# Altium schematic sheet ECG FRONT.SchDoc
size A
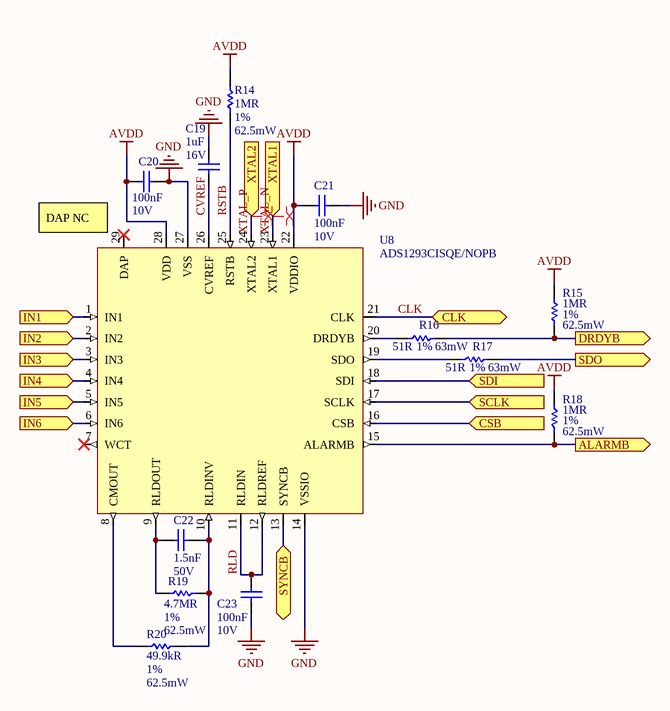
[diagram p0: ECG FRONT.SchDoc]

## Parts
C19  Voltage Rating: 16V  Capacitance: 1uF  [0402 CAPACITOR]  (hidden comment: EMK105BJ105KV-F)
C20  Capacitance: 100nF  Voltage Rating: 10V  [0402 CAPACITOR]  (hidden comment: C0402C104K8PACTU)
C21  Capacitance: 100nF  Voltage Rating: 10V  [0402 CAPACITOR]  (hidden comment: C0402C104K8PACTU)
C22  Capacitance: 1.5nF  Voltage Rating: 50V  [0402 CAPACITOR]  (hidden comment: 0402B152J500CT)
C23  Capacitance: 100nF  Voltage Rating: 10V  [0402 CAPACITOR]  (hidden comment: C0402C104K8PACTU)
R14  Resistance: 1MR  Tolerance: 1%  Power Rating: 62.5mW  [0402 RESISTOR]  (hidden comment: MCWR04X1004FTL)
R15  Resistance: 1MR  Tolerance: 1%  Power Rating: 62.5mW  [0402 RESISTOR]  (hidden comment: MCWR04X1004FTL)
R16  Resistance: 51R  Tolerance: 1%  Power Rating: 63mW  [0402 RESISTOR]  (hidden comment: CRCW040251R0FKED)
R17  Resistance: 51R  Tolerance: 1%  Power Rating: 63mW  [0402 RESISTOR]  (hidden comment: CRCW040251R0FKED)
R18  Resistance: 1MR  Tolerance: 1%  Power Rating: 62.5mW  [0402 RESISTOR]  (hidden comment: MCWR04X1004FTL)
R19  Resistance: 4.7MR  Tolerance: 1%  Power Rating: 62.5mW  [0402 RESISTOR]  (hidden comment: MCWR04W4704FTL)
R20  Resistance: 49.9kR  Tolerance: 1%  Power Rating: 62.5mW  [0402 RESISTOR]  (hidden comment: MCWR04X4992FTL)
U8  ADS1293CISQE/NOPB  [QFN50P500X500X80_HS-29N]

## Ports
ALARMB (out), CLK (bidir), CSB (in), DRDYB (out), IN1 (in), IN2 (in), IN3 (in), IN4 (in), IN5 (in), IN6 (in), SCLK (in), SDI (in), SDO (out), SYNCB (bidir), XTAL1 (in), XTAL2 (in)

## Nets
AVDD: C20.1 C21.1 R14.2 R15.2 R18.2 U8.22(VDDIO) U8.28(VDD)
GND: C19.2 C20.2 C21.2 C23.2 U8.14(VSSIO) U8.27(VSS)
ALARMB: R18.1 U8.15(ALARMB) ; port ALARMB
CLK: U8.21(CLK) ; port CLK
CSB: U8.16(CSB) ; port CSB
CVREF: C19.1 U8.26(CVREF)
DRDYB: R15.1 R16.2 ; port DRDYB
IN1: U8.1(IN1) ; port IN1
IN2: U8.2(IN2) ; port IN2
IN3: U8.3(IN3) ; port IN3
IN4: U8.4(IN4) ; port IN4
IN5: U8.5(IN5) ; port IN5
IN6: U8.6(IN6) ; port IN6
RLD: C23.1 U8.11(RLDIN) U8.12(RLDREF)
RSTB: R14.1 U8.25(RSTB)
SCLK: U8.17(SCLK) ; port SCLK
SDI: U8.18(SDI) ; port SDI
SDO: R17.2 ; port SDO
SYNCB: U8.13(SYNCB) ; port SYNCB
XTAL_N: U8.23(XTAL1) ; port XTAL1
XTAL_P: U8.24(XTAL2) ; port XTAL2
NetC22_1: C22.1 R19.1 R20.1 U8.10(RLDINV)
NetC22_2: C22.2 R19.2 U8.9(RLDOUT)
NetR16_1: R16.1 U8.20(DRDYB)
NetR17_1: R17.1 U8.19(SDO)
NetR20_2: R20.2 U8.8(CMOUT)

Not connected (* = marked no-connect by the designer): U8 7(WCT)* 29(DAP)*

## Layout directives
differential pair; differential pair class XTAL: XTAL_N, XTAL_P

## Notes on the sheet
- (near U8) DAP NC

## Library data of the parts
C19 = CMP-001-00084-6: Cap Ceramic 1uF 16V X5R 10% SMD 0402 85°C; Case Code (Metric): 1005; Thickness: 0.022inch; REACH SVHC: Unknown; Termination: SMD/SMT; Packaging: Tape and Reel; Max Operating Temperature: 85°C; Package Quantity: 1; Tolerance: 10%; Mount: Surface Mount; Number of Pins: 2; Halogen Free: Halogen Free; Height: 0.5mm; Voltage Rating (DC): 16V; Case Code (Imperial): 0402; Case/Package: 0402; Width: 0.02inch; Depth: 0.5mm; Radiation Hardening: No; Min Operating Temperature: -55°C; Length: 1mm; Dielectric: X5R
C20 C21 C23 = CMP-001-00061-5: Cap Ceramic 0.1uF 10V X5R 10% SMD 0402 85°C; Dissipation Factor: 5%; Number of Pins: 2; Case Code (Metric): 1005; Min Operating Temperature: -55°C; Thickness: 0.022inch; Radiation Hardening: No; Packaging: Tape and Reel; Depth: 0.5mm; Voltage: 10V; Lead Pitch: 0.3mm; Voltage Rating (DC): 10V; Mount: Surface Mount,PCB; Max Operating Temperature: 85°C; Termination: SMD/SMT; Case Code (Imperial): 0402; Width: 0.02inch; REACH SVHC: No SVHC; Contact Plating: Tin,Matte; Length: 1mm; Package Quantity: 1; Dielectric: X5R; Tolerance: 10%; Lead Free: Lead Free; Dielectric Material: Ceramic; Case/Package: 0402; Height: 0.5mm
C22 = CMP-001-00089-2: Cap Ceramic 1.5nF 50V X7R 5% SMD 0402 125°C; Packaging: Tape and Reel; Max Operating Temperature: 125°C; Case Code (Metric): 1005; Length: 1mm; Voltage Rating (DC): 50V; Tolerance: 5%; Min Operating Temperature: -55°C; REACH SVHC: Unknown; Case Code (Imperial): 0402; Dielectric: X7R; Depth: 0.5mm; Case/Package: 0402
R14 R15 R18 = CMP-009-00177-1: 1MR 0402; Voltage Rating (DC): 50V; Temperature Coefficient: 100ppm/°C; Case Code (Metric): 1005; Case/Package: 0402; Voltage Rating: 50V; Mount: Surface Mount; Packaging: Cut Tape; REACH SVHC: No SVHC; Composition: Thick Film; Case Code (Imperial): 0402
R16 R17 = CMP-009-00186-1: 51R 0402 AEC-Q200; Voltage Rating (DC): 50V; Temperature Coefficient: 100ppm/°C; Lead Free: Lead Free; REACH SVHC: Unknown; Package Quantity: 10; Case Code (Imperial): 0402; Case Code (Metric): 1005; Military Standard: Not; Length: 1mm; Width: 0.5mm; Number of Terminations: 2; Voltage Rating: 50V; Weight: 2.3E-05oz; Case/Package: 0402; Max Operating Temperature: 155°C; Max Power Dissipation: 63mW; Termination: SMD/SMT; Depth: 0.5mm; Packaging: Tape and Reel; Features: Automotive AEC-Q200; Min Operating Temperature: -55°C; Composition: Thick Film; Radiation Hardening: No; Number of Pins: 2; Height: 0.35mm; Contact Plating: Tin
R19 = CMP-009-00181-1: Res Thick FIlm 4.7MR 50V 1% SMD 0402; Temperature Coefficient: 100ppm/°C; REACH SVHC: No SVHC; Voltage Rating: 50V; Voltage Rating (DC): 50V; Case/Package: 0402; Case Code (Metric): 1005; Packaging: Cut Tape; Mount: Surface Mount; Case Code (Imperial): 0402; Composition: Thick Film
R20 = CMP-009-00182-1: Res Thick FIlm 49.9kR 50V 1% SMD 0402; Temperature Coefficient: 100ppm/°C; Packaging: Cut Tape; Composition: Thick Film; Voltage Rating: 50V; Case/Package: 0402; REACH SVHC: No SVHC; Voltage Rating (DC): 50V; Case Code (Imperial): 0402; Case Code (Metric): 1005
U8 = CMP-014-00002-4: AFE General Purpose 3ADC 24-Bit 3.3V/5V 28-Pin LLP EP T/R; Operating Supply Current: 825uA; Number of Channels: 3; Resolution: 24b; Max Supply Voltage: 5.5V; Interface: SPI; Signal to Noise Ratio (SNR): 110dB; Min Supply Voltage: 2.7V; Conversion Rate: 25.6KS/s; Number of Bits: 24; Sampling Rate: 25KS/s; REACH SVHC: No SVHC; Length: 5mm; Max Operating Temperature: 85°C; Radiation Hardening: No; Type: General Purpose; Number of Pins: 28; Height: 0.8mm; Mount: Surface Mount; Min Operating Temperature: -20°C; Lead Free: Lead Free; Width: 5mm; Number of A/D Converters: 3; Packaging: Tape and Reel; Number of Converters: 3; Number of Inputs: 3